# Altium project BrewBitTC.PrjPCB
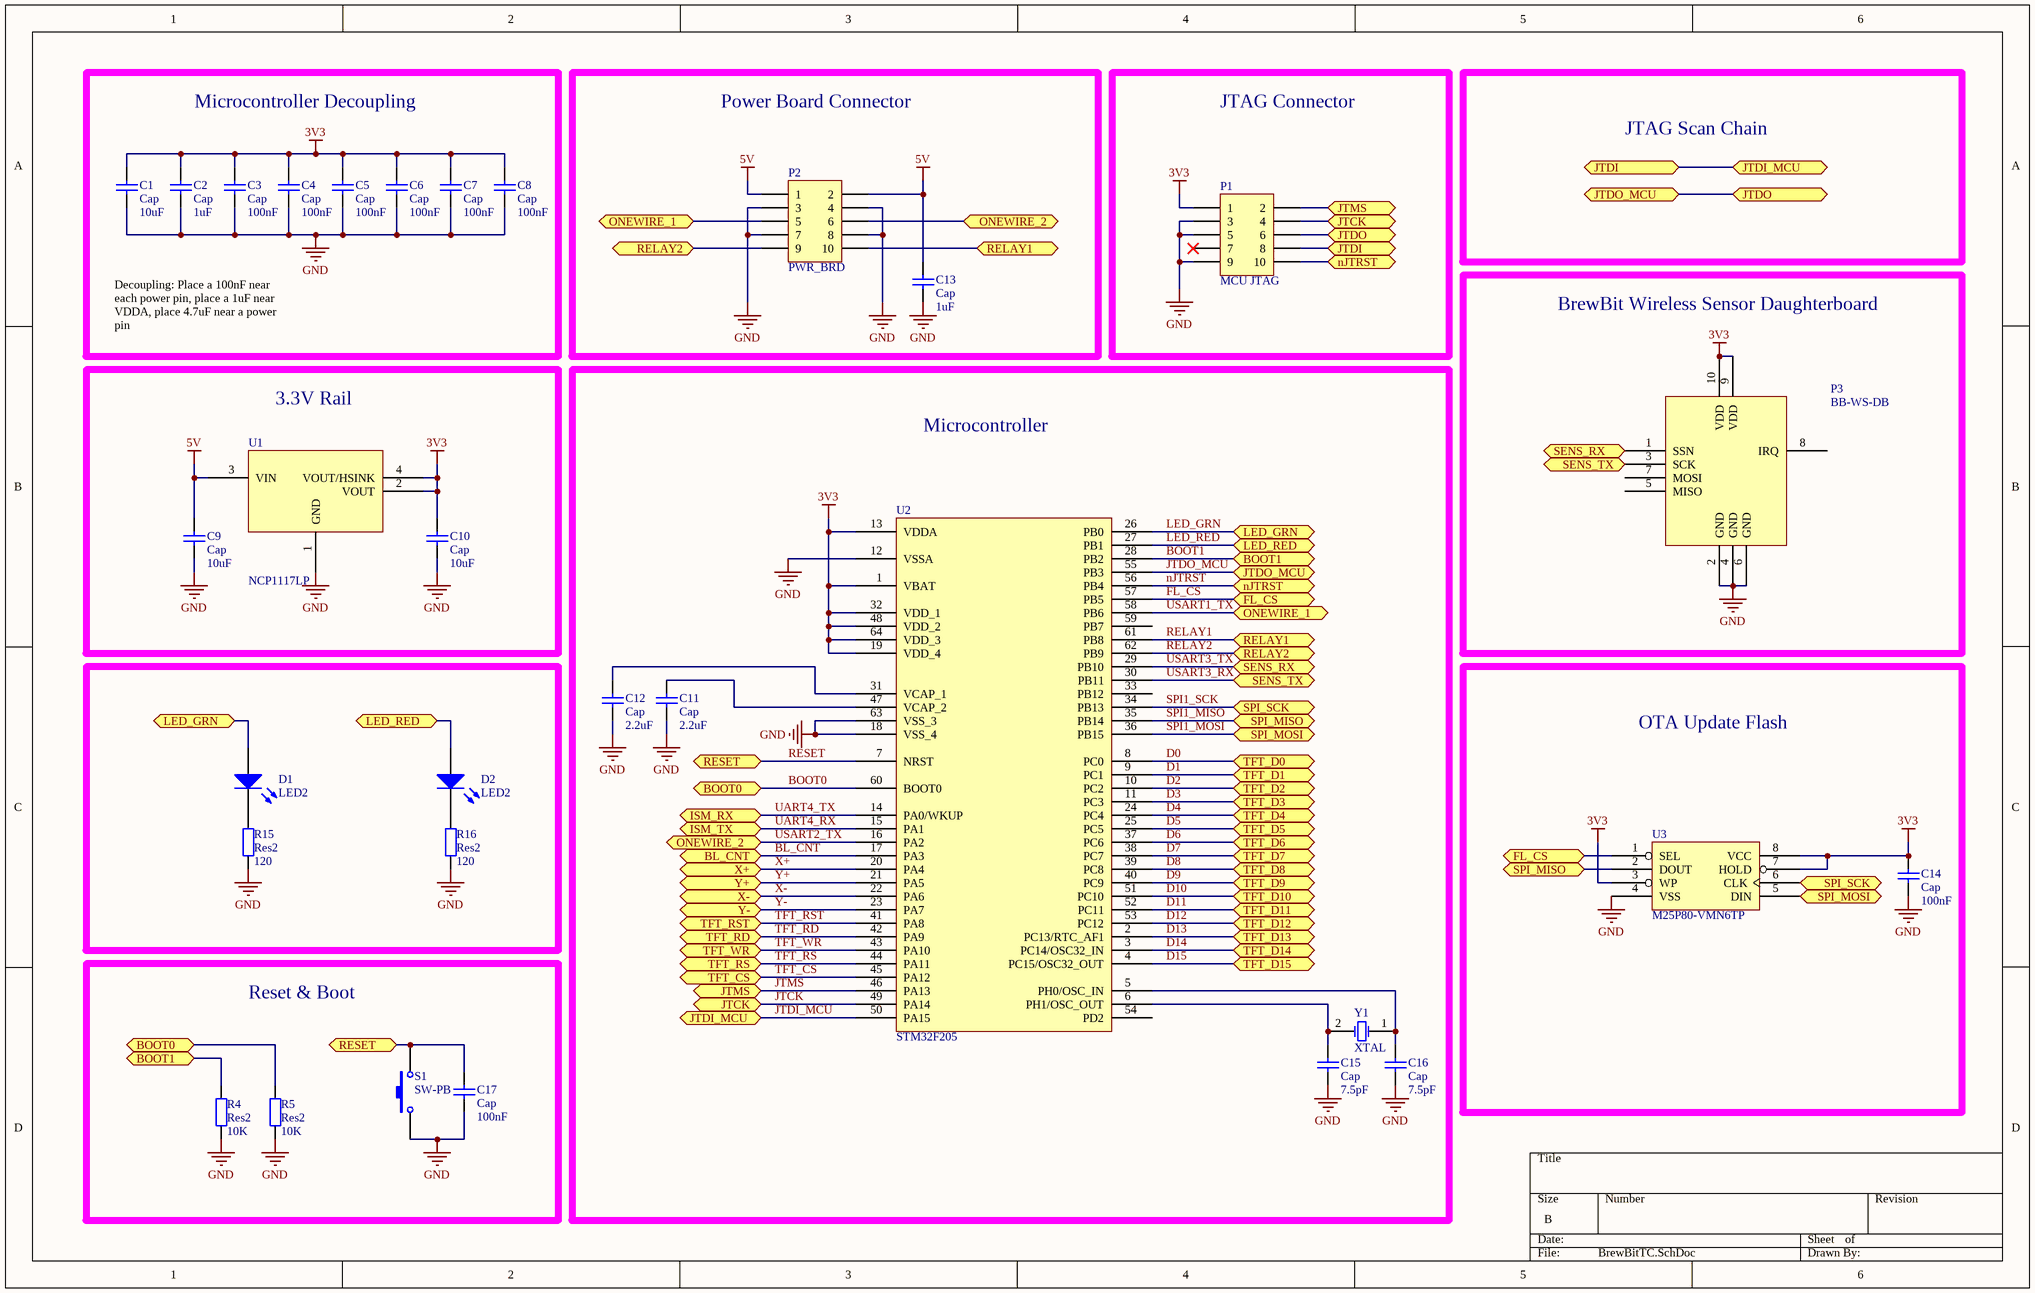
[diagram p0: BrewBitTC.SchDoc]
3 sheets, 46 parts. Net scope: flat (ports and power ports of the same name join across sheets).
Board file: BrewBitTC.PcbDoc
Sheets:
  BrewBitTC.SchDoc
  ISM4319.SchDoc
  LCD.SchDoc

## Sheet BrewBitTC.SchDoc
size B

### Parts
C1  Cap  value 10uF  [0805]
C2  Cap  value 1uF  [0603]
C3  Cap  value 100nF  [0603]
C4  Cap  value 100nF  [0603]
C5  Cap  value 100nF  [0603]
C6  Cap  value 100nF  [0603]
C7  Cap  value 100nF  [0603]
C8  Cap  value 100nF  [0603]
C9  Cap  value 10uF  [0805]
C10  Cap  value 10uF  [0805]
C11  Cap  value 2.2uF  [0603]
C12  Cap  value 2.2uF  [0603]
C13  Cap  value 1uF  [0603]
C14  Cap  value 100nF  [0603]
C15  Cap  value 7.5pF  [0603]
C16  Cap  value 7.5pF  [0603]
C17  Cap  value 100nF  [0603]
D1  LED2  [0603]
D2  LED2  [0603]
P1  MCU JTAG  [5x2 PIN SMT HEADER]
P2  PWR_BRD  [5X2 PIN SMT HEADER - 2.0MM]
P3  BB-WS-DB  [10 Pin SMT Header]
R4  Res2  value 10K  [0603]
R5  Res2  value 10K  [0603]
R15  Res2  value 120  [0603]
R16  Res2  value 120  [0603]
S1  SW-PB  [FSM4JSMA]
U1  NCP1117LP  [SOT-223]
U2  STM32F205  [LQFP64]
U3  M25P80-VMN6TP  [SO8N]
Y1  XTAL  [HC49SD XTAL]

### Blocks framed on the sheet
Microcontroller Decoupling: C1-C8
Power Board Connector: C13 P2
JTAG Connector: P1
BrewBit Wireless Sensor Daughterboard: P3
3.3V Rail: C9 C10 U1
Microcontroller: C11 C12 C15 C16 U2 Y1
OTA Update Flash: C14 U3
Reset & Boot: C17 R4 R5 S1

### Ports
BL_CNT, BOOT0, BOOT1, FL_CS, ISM_RX, ISM_TX, JTCK, JTDI, JTDI_MCU, JTDO, JTDO_MCU, JTMS, LED_GRN, LED_RED, nJTRST, ONEWIRE_1, ONEWIRE_2, RELAY1, RELAY2, RESET, SENS_RX, SENS_TX, SPI_MISO, SPI_MOSI, SPI_SCK, TFT_CS, TFT_D0, TFT_D1, TFT_D2, TFT_D3, TFT_D4, TFT_D5, TFT_D6, TFT_D7, TFT_D8, TFT_D9, TFT_D10, TFT_D11, TFT_D12, TFT_D13, TFT_D14, TFT_D15, TFT_RD, TFT_RS, TFT_RST, TFT_WR, X+, X-, Y+, Y-

### Nets
3V3: C1.2 C2.2 C3.2 C4.2 C5.2 C6.2 C7.2 C8.2 C10.2 C14.2 P1.1 P3.9(VDD) P3.10(VDD) U1.2(VOUT) U1.4(VOUT/HSINK) U2.1(VBAT) U2.13(VDDA) U2.19(VDD_4) U2.32(VDD_1) U2.48(VDD_2) U2.64(VDD_3) U3.3(WP) U3.7(HOLD) U3.8(VCC)
5V: C9.2 C13.2 P2.1 P2.2 U1.3(VIN)
GND: C1.1 C2.1 C3.1 C4.1 C5.1 C6.1 C7.1 C8.1 C9.1 C10.1 C11.1 C12.1 C13.1 C14.1 C15.1 C16.1 C17.1 P1.3 P1.5 P1.9 P2.3 P2.4 P2.7 P2.8 P3.2(GND) P3.4(GND) P3.6(GND) R4.1 R5.1 R15.1 R16.1 S1.1 U1.1(GND) U2.12(VSSA) U2.18(VSS_4) U2.63(VSS_3) U3.4(VSS)
BL_CNT: U2.17(PA3) ; port BL_CNT
BOOT0: R5.2 U2.60(BOOT0) ; port BOOT0
BOOT1: R4.2 U2.28(PB2) ; port BOOT1
D0: U2.8(PC0) ; port TFT_D0
D1: U2.9(PC1) ; port TFT_D1
D2: U2.10(PC2) ; port TFT_D2
D3: U2.11(PC3) ; port TFT_D3
D4: U2.24(PC4) ; port TFT_D4
D5: U2.25(PC5) ; port TFT_D5
D6: U2.37(PC6) ; port TFT_D6
D7: U2.38(PC7) ; port TFT_D7
D8: U2.39(PC8) ; port TFT_D8
D9: U2.40(PC9) ; port TFT_D9
D10: U2.51(PC10) ; port TFT_D10
D11: U2.52(PC11) ; port TFT_D11
D12: U2.53(PC12) ; port TFT_D12
D13: U2.2(PC13/RTC_AF1) ; port TFT_D13
D14: U2.3(PC14/OSC32_IN) ; port TFT_D14
D15: U2.4(PC15/OSC32_OUT) ; port TFT_D15
FL_CS: U2.57(PB5) U3.1(SEL) ; port FL_CS
JTCK: P1.4 U2.49(PA14) ; port JTCK
JTDI_MCU: P1.8 U2.50(PA15) ; port JTDI, port JTDI_MCU
JTDO_MCU: P1.6 U2.55(PB3) ; port JTDO, port JTDO_MCU
JTMS: P1.2 U2.46(PA13) ; port JTMS
LED_GRN: D1.1(A) U2.26(PB0) ; port LED_GRN
LED_RED: D2.1(A) U2.27(PB1) ; port LED_RED
nJTRST: P1.10 U2.56(PB4) ; port nJTRST
RELAY1: P2.10 U2.61(PB8) ; port RELAY1
RELAY2: P2.9 U2.62(PB9) ; port RELAY2
RESET: C17.2 S1.2 U2.7(NRST) ; port RESET
SPI1_MISO: U2.35(PB14) U3.2(DOUT) ; port SPI_MISO
SPI1_MOSI: U2.36(PB15) U3.5(DIN) ; port SPI_MOSI
SPI1_SCK: U2.34(PB13) U3.6(CLK) ; port SPI_SCK
TFT_CS: U2.45(PA12) ; port TFT_CS
TFT_RD: U2.42(PA9) ; port TFT_RD
TFT_RS: U2.44(PA11) ; port TFT_RS
TFT_RST: U2.41(PA8) ; port TFT_RST
TFT_WR: U2.43(PA10) ; port TFT_WR
UART4_RX: U2.15(PA1) ; port ISM_TX  [project net ISM_TX]
UART4_TX: U2.14(PA0/WKUP) ; port ISM_RX  [project net ISM_RX]
USART1_TX: P2.5 U2.58(PB6) ; port ONEWIRE_1
USART2_TX: P2.6 U2.16(PA2) ; port ONEWIRE_2
USART3_RX: P3.3(SCK) U2.30(PB11) ; port SENS_TX
USART3_TX: P3.1(SSN) U2.29(PB10) ; port SENS_RX
X+: U2.20(PA4) ; port X+
X-: U2.22(PA6) ; port X-
Y+: U2.21(PA5) ; port Y+
Y-: U2.23(PA7) ; port Y-
NetC11_2: C11.2 U2.47(VCAP_2)
NetC12_2: C12.2 U2.31(VCAP_1)
NetC15_2: C15.2 U2.6(PH1/OSC_OUT) Y1.2(OSC2)
NetC16_2: C16.2 U2.5(PH0/OSC_IN) Y1.1(OSC1)
NetD1_2: D1.2(K) R15.2
NetD2_2: D2.2(K) R16.2

Not connected (* = marked no-connect by the designer): P1 7*; P3 5(MISO) 7(MOSI) 8(IRQ); U2 33(PB12) 54(PD2) 59(PB7)

### Notes on the sheet
- JTAG Scan Chain
- Decoupling: Place a 100nF near each power pin, place a 1uF near VDDA, place 4.7uF near a power pin

### Library data of the parts
C1-C17 = Cap: Capacitor; Supplier 1: Digi-Key
  C1 C9 C10: Supplier Part Number 1: 445-6857-1-ND
  C2 C13: Supplier Part Number 1: 587-1242-1-ND
  C3-C8 C14 C17: Supplier Part Number 1: 399-1095-1-ND
  C11 C12: Supplier Part Number 1: 587-2983-1-ND
  C15 C16: Supplier Part Number 1: 490-3565-1-ND
D1 D2 = LED2: Typical RED, GREEN, YELLOW, AMBER GaAs LED; Supplier 1: Digi-Key
  D1: Supplier Part Number 1: 160-1183-1-ND
  D2: Supplier Part Number 1: 160-1181-1-ND
P1 P2 = Header 5X2: Header, 5-Pin, Dual row; Supplier 1: Digi-Key
  P1: Supplier Part Number 1: S9012E-05-ND
  P2: Supplier Part Number 1: 609-2648-1-ND
P3 = BB-WS-DB: BrewBit Wireless Sensor Daughter Board; Supplier Part Number 1: 3M9359CT-ND; Supplier 1: Digi-Key
R4 R5 R15 R16 = Res2: Resistor; Supplier 1: Digi-Key
  R4 R5: Supplier Part Number 1: 311-10KGRCT-ND
  R15 R16: Supplier Part Number 1: P120GCT-ND
S1 = SW-PB: Switch; Supplier Part Number 1: 450-1129-ND; Supplier 1: Digi-Key
U1 = NCP1117LP: 1.0 A Low-Dropout Positive  Fixed and Adjustable  Voltage Regulators; Supplier 1: Digi-Key; Supplier Part Number 1: NCP1117LPST33T3GOSCT-ND
U2 = STM32F20x-LQFP64: STMicroelectronics STM32F20x LQFP64; Supplier 1: Digi-Key; Supplier Part Number 1: 497-11155-ND
U3 = M25P80-VMN6TP: IC FLASH 8MBIT 75MHZ SO8N; Supplier 1: Digi-Key; Supplier Part Number 1: M25P80-VMN6TPCT-ND
Y1 = XTAL: Crystal Oscillator; Supplier 1: Digi-Key; Supplier Part Number 1: 631-1010-1-ND

## Sheet ISM4319.SchDoc
size A
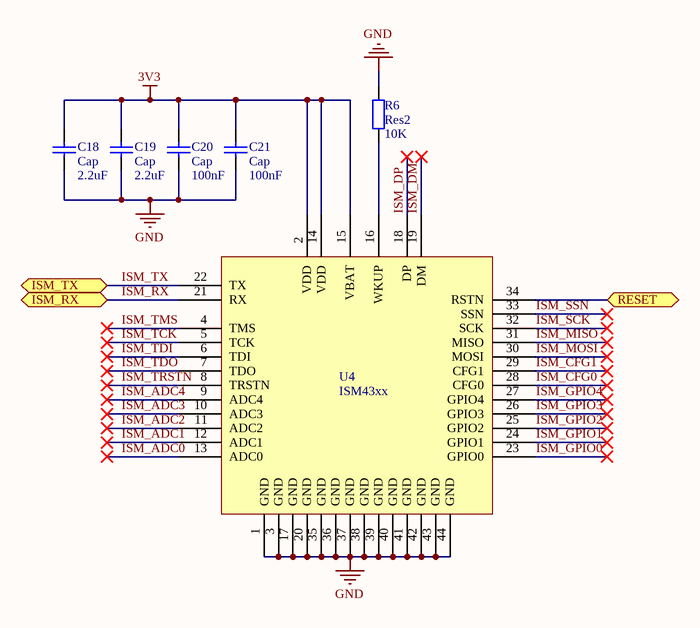
[diagram p1: ISM4319.SchDoc]

### Parts
C18  Cap  value 2.2uF  [0603]
C19  Cap  value 2.2uF  [0603]
C20  Cap  value 100nF  [0603]
C21  Cap  value 100nF  [0603]
R6  Res2  value 10K  [0603]
U4  ISM43xx  [ISM-WIFI]

### Ports
ISM_RX, ISM_TX, RESET

### Nets
3V3: C18.2 C19.2 C20.2 C21.2 U4.2(VDD) U4.14(VDD) U4.15(VBAT)
GND: C18.1 C19.1 C20.1 C21.1 R6.2 U4.1(GND) U4.3(GND) U4.17(GND) U4.20(GND) U4.35(GND) U4.36(GND) U4.37(GND) U4.38(GND) U4.39(GND) U4.40(GND) U4.41(GND) U4.42(GND) U4.43(GND) U4.44(GND)
ISM_ADC0: U4.13(ADC0)
ISM_ADC1: U4.12(ADC1)
ISM_ADC2: U4.11(ADC2)
ISM_ADC3: U4.10(ADC3)
ISM_ADC4: U4.9(ADC4)
ISM_CFG0: U4.28(CFG0)
ISM_CFG1: U4.29(CFG1)
ISM_DM: U4.19(DM)
ISM_DP: U4.18(DP)
ISM_GPIO0: U4.23(GPIO0)
ISM_GPIO1: U4.24(GPIO1)
ISM_GPIO2: U4.25(GPIO2)
ISM_GPIO3: U4.26(GPIO3)
ISM_GPIO4: U4.27(GPIO4)
ISM_MISO: U4.31(MISO)
ISM_MOSI: U4.30(MOSI)
ISM_RX: U4.21(RX) ; port ISM_RX
ISM_SCK: U4.32(SCK)
ISM_SSN: U4.33(SSN)
ISM_TCK: U4.5(TCK)
ISM_TDI: U4.6(TDI)
ISM_TDO: U4.7(TDO)
ISM_TMS: U4.4(TMS)
ISM_TRSTN: U4.8(TRSTN)
ISM_TX: U4.22(TX) ; port ISM_TX
RESET: U4.34(RSTN) ; port RESET
NetR6_1: R6.1 U4.16(WKUP)

### Library data of the parts
C18-C21 = Cap: Capacitor; Supplier 1: Digi-Key
  C18 C19: Supplier Part Number 1: 587-2983-1-ND
  C20 C21: Supplier Part Number 1: 399-1095-1-ND
R6 = Res2: Resistor; Supplier 1: Digi-Key; Supplier Part Number 1: 311-10KGRCT-ND
U4 = ISM4319: Inventek Systems WiFi Module

## Sheet LCD.SchDoc
size A
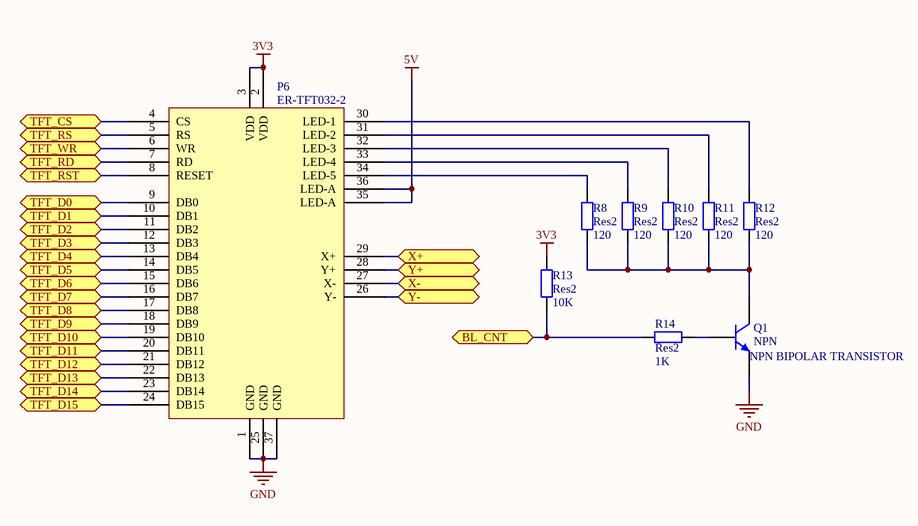
[diagram p2: LCD.SchDoc]

### Parts
P6  ER-TFT032-2  [ER-TFT032-2]
Q1  NPN  value NPN BIPOLAR TRANSISTOR  [SOT23_M]
R8  Res2  value 120  [0603]
R9  Res2  value 120  [0603]
R10  Res2  value 120  [0603]
R11  Res2  value 120  [0603]
R12  Res2  value 120  [0603]
R13  Res2  value 10K  [0603]
R14  Res2  value 1K  [0603]

### Ports
BL_CNT, TFT_CS, TFT_D0, TFT_D1, TFT_D2, TFT_D3, TFT_D4, TFT_D5, TFT_D6, TFT_D7, TFT_D8, TFT_D9, TFT_D10, TFT_D11, TFT_D12, TFT_D13, TFT_D14, TFT_D15, TFT_RD, TFT_RS, TFT_RST, TFT_WR, X+, X-, Y+, Y-

### Nets
3V3: P6.2(VDD) P6.3(VDD) R13.2
5V: P6.35(LED-A) P6.36(LED-A)
GND: P6.1(GND) P6.25(GND) P6.37(GND) Q1.3(E)
BL_CNT: R13.1 R14.2 ; port BL_CNT
D0: P6.9(DB0) ; port TFT_D0
D1: P6.10(DB1) ; port TFT_D1
D2: P6.11(DB2) ; port TFT_D2
D3: P6.12(DB3) ; port TFT_D3
D4: P6.13(DB4) ; port TFT_D4
D5: P6.14(DB5) ; port TFT_D5
D6: P6.15(DB6) ; port TFT_D6
D7: P6.16(DB7) ; port TFT_D7
D8: P6.17(DB8) ; port TFT_D8
D9: P6.18(DB9) ; port TFT_D9
D10: P6.19(DB10) ; port TFT_D10
D11: P6.20(DB11) ; port TFT_D11
D12: P6.21(DB12) ; port TFT_D12
D13: P6.22(DB13) ; port TFT_D13
D14: P6.23(DB14) ; port TFT_D14
D15: P6.24(DB15) ; port TFT_D15
TFT_CS: P6.4(CS) ; port TFT_CS
TFT_RD: P6.7(RD) ; port TFT_RD
TFT_RS: P6.5(RS) ; port TFT_RS
TFT_RST: P6.8(RESET) ; port TFT_RST
TFT_WR: P6.6(WR) ; port TFT_WR
X+: P6.29(X+) ; port X+
X-: P6.27(X-) ; port X-
Y+: P6.28(Y+) ; port Y+
Y-: P6.26(Y-) ; port Y-
NetP6_30: P6.30(LED-1) R12.2
NetP6_31: P6.31(LED-2) R11.2
NetP6_32: P6.32(LED-3) R10.2
NetP6_33: P6.33(LED-4) R9.2
NetP6_34: P6.34(LED-5) R8.2
NetQ1_1: Q1.1(C) R8.1 R9.1 R10.1 R11.1 R12.1
NetQ1_2: Q1.2(B) R14.1

### Library data of the parts
P6 = ER-TFT032-2: 3.2" TFT LCD module with touch panel
Q1 = NPN: NPN Bipolar Transistor; pin to pad: 2>3 3>2; Supplier Part Number 1: MMBT2222ALT3GOSCT-ND; Supplier 1: Digi-Key
R8-R14 = Res2: Resistor; Supplier 1: Digi-Key
  R8-R12: Supplier Part Number 1: P120GCT-ND
  R13: Supplier Part Number 1: 311-10KGRCT-ND
  R14: Supplier Part Number 1: 311-1.0KGRCT-ND

## Nets that join several sheets
3V3: BrewBitTC (24 pins), ISM4319 (7 pins), LCD (P6.2 P6.3 R13.2)
5V: BrewBitTC (5 pins), LCD (P6.35 P6.36)
GND: BrewBitTC (37 pins), ISM4319 (19 pins), LCD (P6.1 P6.25 P6.37 Q1.3)
BL_CNT: BrewBitTC (U2.17), LCD (R13.1 R14.2)
D0: BrewBitTC (U2.8), LCD (P6.9)
D1: BrewBitTC (U2.9), LCD (P6.10)
D2: BrewBitTC (U2.10), LCD (P6.11)
D3: BrewBitTC (U2.11), LCD (P6.12)
D4: BrewBitTC (U2.24), LCD (P6.13)
D5: BrewBitTC (U2.25), LCD (P6.14)
D6: BrewBitTC (U2.37), LCD (P6.15)
D7: BrewBitTC (U2.38), LCD (P6.16)
D8: BrewBitTC (U2.39), LCD (P6.17)
D9: BrewBitTC (U2.40), LCD (P6.18)
D10: BrewBitTC (U2.51), LCD (P6.19)
D11: BrewBitTC (U2.52), LCD (P6.20)
D12: BrewBitTC (U2.53), LCD (P6.21)
D13: BrewBitTC (U2.2), LCD (P6.22)
D14: BrewBitTC (U2.3), LCD (P6.23)
D15: BrewBitTC (U2.4), LCD (P6.24)
ISM_RX: BrewBitTC (U2.14), ISM4319 (U4.21)
ISM_TX: BrewBitTC (U2.15), ISM4319 (U4.22)
RESET: BrewBitTC (C17.2 S1.2 U2.7), ISM4319 (U4.34)
TFT_CS: BrewBitTC (U2.45), LCD (P6.4)
TFT_RD: BrewBitTC (U2.42), LCD (P6.7)
TFT_RS: BrewBitTC (U2.44), LCD (P6.5)
TFT_RST: BrewBitTC (U2.41), LCD (P6.8)
TFT_WR: BrewBitTC (U2.43), LCD (P6.6)
X+: BrewBitTC (U2.20), LCD (P6.29)
X-: BrewBitTC (U2.22), LCD (P6.27)
Y+: BrewBitTC (U2.21), LCD (P6.28)
Y-: BrewBitTC (U2.23), LCD (P6.26)